# EAGLE design esp8266 rgb controller v2 (EAGLE 9.0.1)
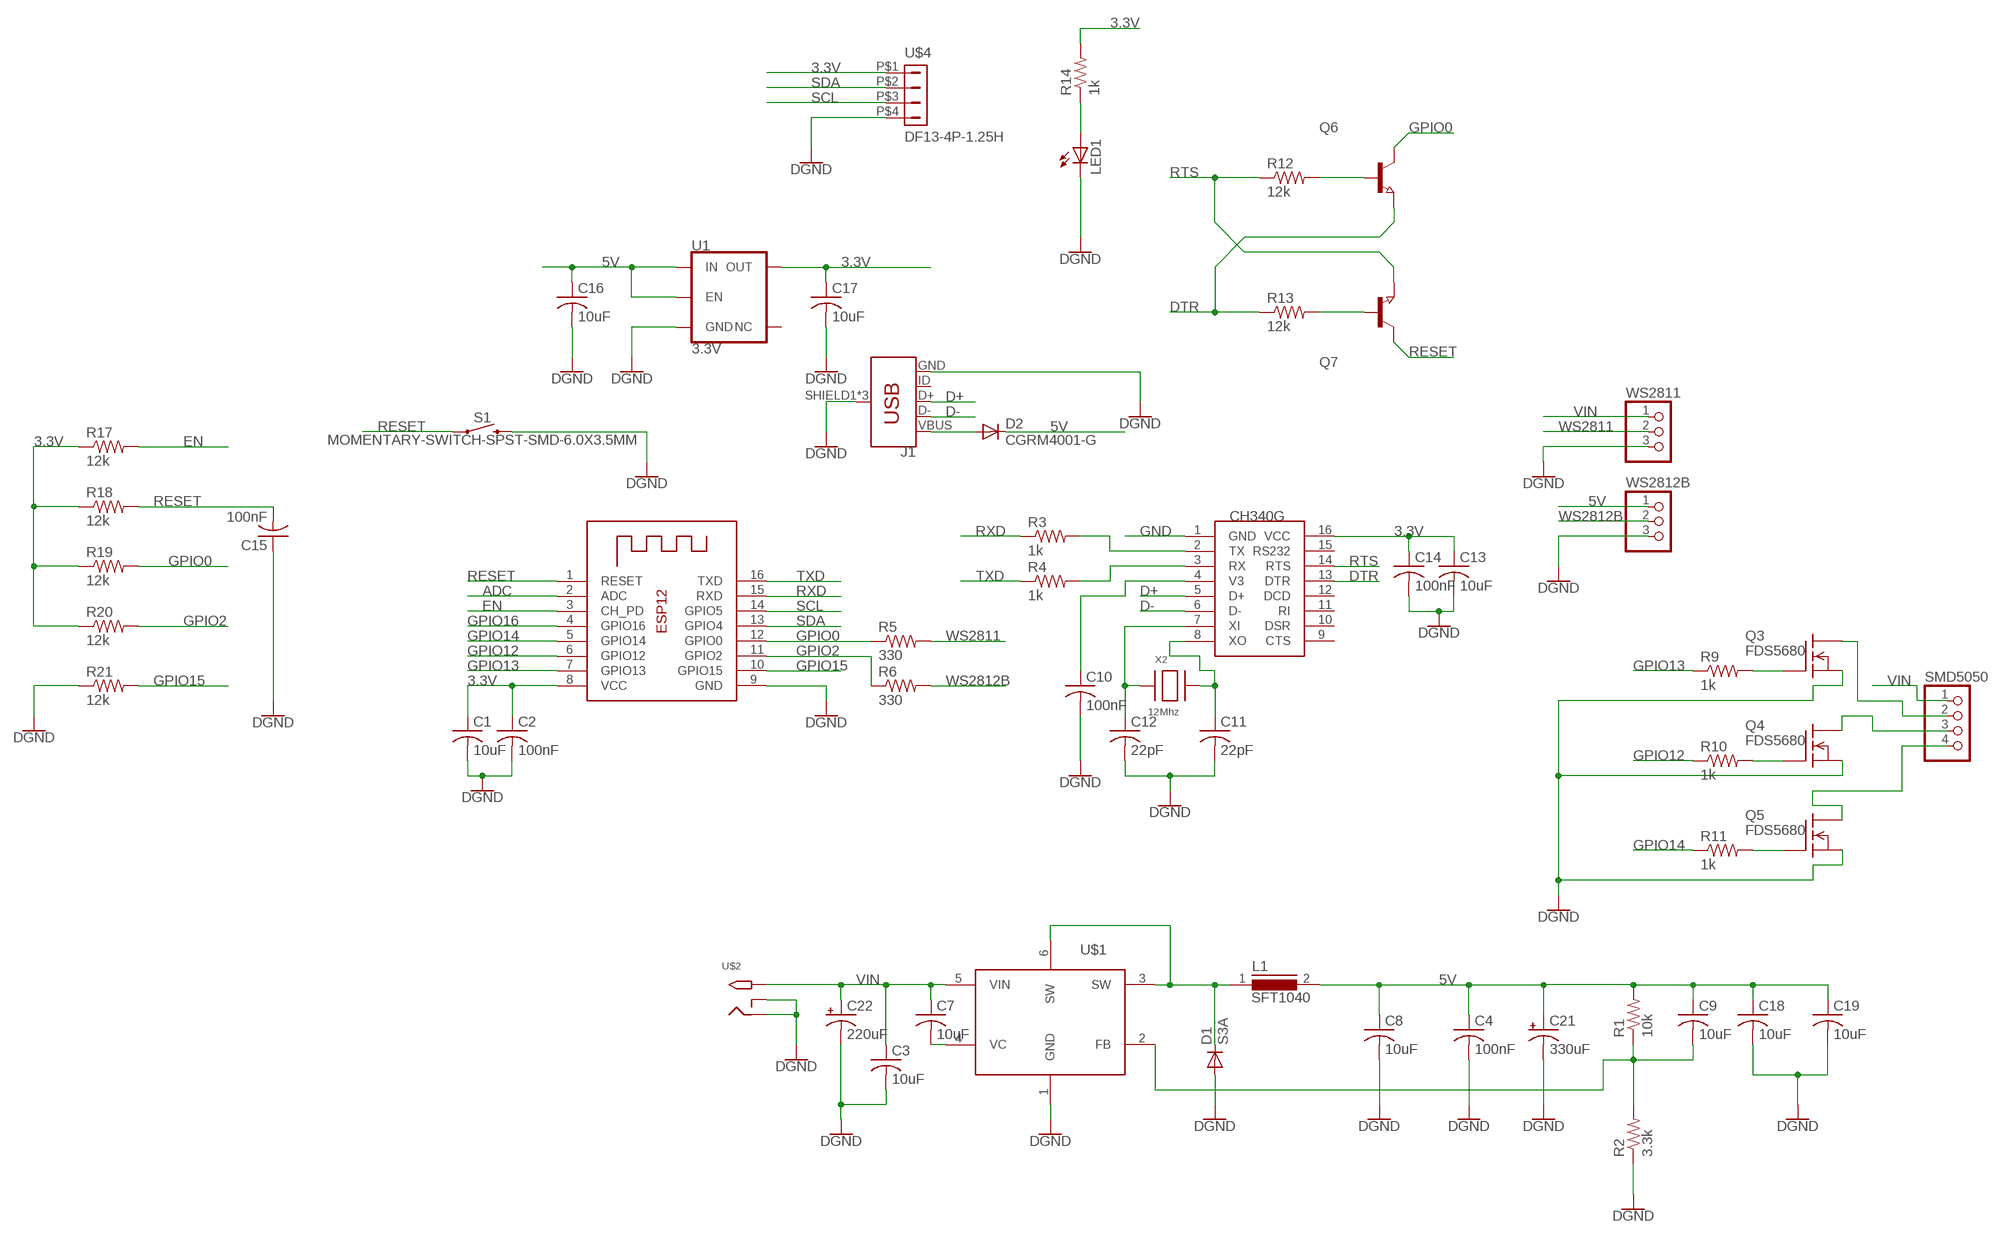
[diagram p0: schematic, sheet 1]

## Parts
C1  10uF  C-USC0805  [C0805]
C2  100nF  C-USC0805  [C0805]
C3  10uF  C-USC0805  [C0805]
C4  100nF  C-USC0805  [C0805]
C7  10uF  C-USC0805  [C0805]
C8  10uF  C-USC0805  [C0805]
C9  10uF  C-USC0805  [C0805]
C10  100nF  C-USC0805  [C0805]
C11  22pF  C-USC0805  [C0805]
C12  22pF  C-USC0805  [C0805]
C13  10uF  C-USC0805  [C0805]
C14  100nF  C-USC0805  [C0805]
C15  100nF  C-USC0805  [C0805]
C16  10uF  C-USC1210  [C1210]
C17  10uF  C-USC0805  [C0805]
C18  10uF  C-USC0805  [C0805]
C19  10uF  C-USC0805  [C0805]
C21  330uF  CPOL-US153CLV-0810  [153CLV-0810]
C22  220uF  CPOL-US153CLV-0810  [153CLV-0810]
D1  S3A  [DO214AB]
D2  CGRM4001-G  [SOD-123_MINI-SMA]
J1  USB_MICRO-BREDUCED_PASTE  [USB-B-MICRO-SMD_RED_PASTE]
L1  SFT1040  [SFT1040]
LED1  LEDCHIP-LED0603  [CHIP-LED0603]
Q3  FDS5680  [SO-8]
Q4  FDS5680  [SO-8]
Q5  FDS5680  [SO-8]
Q6  NPN-TRANSISTOR_SOT23  [SOT23]
Q7  NPN-TRANSISTOR_SOT23  [SOT23]
R1  10k  R-US_R0805  [R0805]
R2  3.3k  R-US_R0805  [R0805]
R3  1k  R-US_R0805  [R0805]
R4  1k  R-US_R0805  [R0805]
R5  330  R-US_R0805  [R0805]
R6  330  R-US_R0805  [R0805]
R9  1k  R-US_R0805  [R0805]
R10  1k  R-US_R0805  [R0805]
R11  1k  R-US_R0805  [R0805]
R12  12k  R-US_R0805  [R0805]
R13  12k  R-US_R0805  [R0805]
R14  1k  R-US_R0805  [R0805]
R17  12k  R-US_R0805  [R0805]
R18  12k  R-US_R0805  [R0805]
R19  12k  R-US_R0805  [R0805]
R20  12k  R-US_R0805  [R0805]
R21  12k  R-US_R0805  [R0805]
S1  MOMENTARY-SWITCH-SPST-SMD-6.0X3.5MM  [TACTILE_SWITCH_SMD_6.0X3.5MM]
SMD5050  PINHD-1X4  [1X04]
U1  3.3V  V_REG_AP2112K-3.3V  [SOT23-5]
U$1  XL4015  [TO263-5]
U$2  2.1MMJACKTHM  [PJ-102A]
U$3  CH340G  [SOIC16]
U$4  DF13-4P-1.25H  [DF13A-4P-1.25H]
WS2811  PINHD-1X3  [1X03]
WS2812B  PINHD-1X3  [1X03]
X1  ESP-12F  [ESP-12]
X2  12Mhz  XTALNX5032  [NX5032]

## Nets
3.3V: C1.1 C2.1 C13.1 C14.1 C17.1 R14.2 R17.1 R18.1 R19.1 R20.1 U1.5(OUT) U$3.16(VCC) U$4.P$1 X1.8(VCC)
5V: C4.1 C8.1 C9.1 C16.1 C18.1 C19.1 C21.+ D2.C L1.2 R1.2 U1.1(IN) U1.3(EN) WS2812B.1
ADC: X1.2(ADC)
D+: J1.D+ U$3.5(D+)
D-: J1.D- U$3.6(D-)
DTR: Q6.2(E) R13.1 U$3.13(DTR)
EN: R17.2 X1.3(CH_PD)
GND: C1.2 C2.2 C3.2 C4.2 C8.2 C10.2 C11.2 C12.2 C13.2 C14.2 C15.1 C16.2 C17.2 C18.2 C19.2 C21.- C22.- D1.A J1.GND J1.SHIELD1(SHIELD) J1.SHIELD2(SHIELD) J1.SHIELD3(SHIELD) LED1.C Q3.1(S) Q3.2(S) Q3.3(S) Q4.1(S) Q4.2(S) Q4.3(S) Q5.1(S) Q5.2(S) Q5.3(S) R2.1 R21.1 S1.2 U1.2(GND) U$1.1(GND) U$2.RING U$2.RING_SW U$3.1(GND) U$4.P$4 WS2811.3 WS2812B.3 X1.9(GND) ; supply symbol labelled DGND
GPIO0: Q6.3(C) R5.1 R19.2 X1.12(GPIO0)
GPIO2: R6.1 R20.2 X1.11(GPIO2)
GPIO12: R10.1 X1.6(GPIO12)
GPIO13: R9.1 X1.7(GPIO13)
GPIO14: R11.1 X1.5(GPIO14)
GPIO15: R21.2 X1.10(GPIO15)
GPIO16: X1.4(GPIO16)
N$1: Q3.5(D) Q3.6(D) Q3.7(D) Q3.8(D) SMD5050.2
N$2: D1.C L1.1 U$1.3(SW) U$1.6(SW)
N$3: Q4.5(D) Q4.6(D) Q4.7(D) Q4.8(D) SMD5050.3
N$4: D2.A J1.VBUS
N$5: R3.2 U$3.2(TX)
N$6: R4.2 U$3.3(RX)
N$7: C10.1 U$3.4(V3)
N$8: Q5.5(D) Q5.6(D) Q5.7(D) Q5.8(D) SMD5050.4
N$9: Q6.1(B) R12.2
N$10: C12.1 U$3.7(XI) X2.P$1
N$11: C11.1 U$3.8(XO) X2.P$2
N$12: Q5.4(G) R11.2
N$14: Q7.1(B) R13.2
N$15: C7.2 U$1.4(VC)
N$16: Q4.4(G) R10.2
N$17: Q3.4(G) R9.2
N$18: LED1.A R14.1
N$19: C9.2 R1.1 R2.2 U$1.2(FB)
RESET: C15.2 Q7.3(C) R18.2 S1.1 X1.1(RESET)
RTS: Q7.2(E) R12.1 U$3.14(RTS)
RXD: R3.1 X1.15(RXD)
SCL: U$4.P$3 X1.14(GPIO5)
SDA: U$4.P$2 X1.13(GPIO4)
TXD: R4.1 X1.16(TXD)
VIN: C3.1 C7.1 C22.+ SMD5050.1 U$1.5(VIN) U$2.TIP WS2811.1
WS2811: R5.2 WS2811.2
WS2812B: R6.2 WS2812B.2
Unconnected: J1.ID U1.4(NC) U$3.9(CTS) U$3.10(DSR) U$3.11(RI) U$3.12(DCD) U$3.15(RS232)

## Library data of the parts
C1-C4 C7-C19 = rcl:C-US: CAPACITOR, American symbol; SPICEPREFIX: C
C21 C22 = rcl:CPOL-US: POLARIZED CAPACITOR, American symbol; SPICEPREFIX: C
D1 = s3x_10:S3*: S3A - S3N General Purpose Rectifiers Source: http://www.fairchildsemi.com/datasheets/S3/S3A.pdf; MF: Fairchild; MPN: S3A; OC_FARNELL: 1017803; OC_NEWARK: 58K2395
D2 = diode:CGRM400*-G: Molded plasitc,JEDEC SOD-123/Mini SMA Source: Comchip CGRM4001-G.pdf
J1 = SparkFun-Connectors:USB_MICRO-B: USB Type Micro-B Connector Male/female and PTH/SMT variants SparkFun Products: SparkFun microB USB Breakout <https://www.sparkfun.com/products/12035> SparkFun USB microB Plug Breakout <https://www.sparkfun.com/products/10031> SparkFun ESP8266 Thing <https://www.sparkfun.com/products/13231>; PROD_ID: CONN-11752
L1 = inductors:SFT1040: INDUCTOR; SPICEPREFIX: L
LED1 = led:LED: LED OSRAM: - CHIPLED LG R971, LG N971, LY N971, LG Q971, LY Q971, LO R971, LY R971 LH N974, LH R974 LS Q976, LO Q976, LY Q976 LO Q996 - Hyper CHIPLED LW Q18S LB Q993, LB Q99A, LB R99A - SideLED LS A670, LO A670, LY A670, LG A670, LP A670 LB A673, LV A673, LT A673, LW A673 LH A674 LY A675 LS A676, LA A676, LO A676, LY A676, LW A676 LS A679, LY A679, LG A679 - Hyper Micro SIDELED® LS Y876, LA Y876, LO Y876, LY Y876 LT Y87S - SmartLED LW L88C, LW L88S LB L89C, LB L89S, LG L890 LS L89K, LO L89K, LY L89K LS L896, LA L896, LO L896, LY L896 - TOPLED LS T670, LO T670, LY T670, LG T670, LP T670 LSG T670, LSP T670, LSY T670, LOP T670, LYG T670 LG T671, LOG T671, LSG T671 LB T673, LV T673, LT T673, LW T673 LH T674 LS T676, LA T676, LO T676, LY T676, LB T676, LH T676, LSB T676, LW T676 LB T67C, LV T67C, LT T67C, LS T67K, LO T67K, LY T67K, LW E67C LS E67B, LA E67B, LO E67B, LY E67B, LB E67C, LV E67C, LT E67C LW T67C LS T679, LY T679, LG T679 LS T770, LO T770, LY T770, LG T770, LP T770 LB T773, LV T773, LT T773, LW T773 LH T774 LS E675, LA E675, LY E675, LS T675 LS T776, LA T776, LO T776, LY T776, LB T776 LHGB T686 LT T68C, LB T68C - Hyper Mini TOPLED® LB M676 - Mini TOPLED Santana® LG M470 LS M47K, LO M47K, LY M47K Source: http://www.osram.convergy.de LUXEON: - LUMILED® LXK2-PW12-R00, LXK2-PW12-S00, LXK2-PW14-U00, LXK2-PW14-V00 LXK2-PM12-R00, LXK2-PM12-S00, LXK2-PM14-U00 LXK2-PE12-Q00, LXK2-PE12-R00, LXK2-PE12-S00, LXK2-PE14-T00, LXK2-PE14-U00 LXK2-PB12-K00, LXK2-PB12-L00, LXK2-PB12-M00, LXK2-PB14-N00, LXK2-PB14-P00, LXK2-PB14-Q00 LXK2-PR12-L00, LXK2-PR12-M00, LXK2-PR14-Q00, LXK2-PR14-R00 LXK2-PD12-Q00, LXK2-PD12-R00, LXK2-PD12-S00 LXK2-PH12-R00, LXK2-PH12-S00 LXK2-PL12-P00, LXK2-PL12-Q00, LXK2-PL12-R00 Source: www.luxeon.com KINGBRIGHT: KA-3528ASYC Source: www.kingbright.com
Q3-Q5 = transistor-fet:FDS5680: 60V N-Channel PowerTrench TM MOSFET FAIRCHILD FDS5680.pdf
Q6 Q7 = semicon-smd-ipc:NPN-TRANSISTOR_: NPN TRANSISTOR
R1-R6 R9-R14 R17-R21 = rcl:R-US_: RESISTOR, American symbol; SPICEPREFIX: R
S1 = SparkFun-Switches:MOMENTARY-SWITCH-SPST: Momentary Switch (Pushbutton) - SPST Normally-open (NO) SPST momentary switches (buttons, pushbuttons). Variants PTH-12MM - 12mm square, through-hole Momentary Pushbutton Switch - 12mm Square <https://www.sparkfun.com/products/9190> (COM-09190) PTH-6.0MM, PTH-6.0MM-KIT - 6.0mm square, through-hole Mini Pushbutton Switch <https://www.sparkfun.com/products/97> (COM-00097) KIT package intended for soldering kit's - only one side of pads' copper is exposed. PTH-RIGHT-ANGLE-KIT - Right-angle, through-hole Right Angle Tactile Button <https://www.sparkfun.com/products/10791> - Used on SparkFun BigTime Watch Kit <https://www.sparkfun.com/products/11734> SMD-12MM - 12mm square, surface-mount Tactile Button - SMD (12mm) <https://www.sparkfun.com/products/12993> (COM-12993) Used on SparkFun PicoBoard <https://www.sparkfun.com/products/11888> SMD-4.5MM - 4.5mm Square Trackball Switch Used on SparkFun Blackberry Trackballer Breakout <https://www.sparkfun.com/products/13169> SMD-4.6MMX2.8MM - 4.60mm x 2.80mm, surface mount Used on SparkFun SAMD21 Mini Breakout <https://www.sparkfun.com/products/13664> SMD-5.2MM, SMD-5.2-REDUNDANT - 5.2mm square, surface-mount Mini Pushbutton Switch - SMD <https://www.sparkfun.com/products/8720> (COM-08720) Used on Arduino Pro Mini <https://www.sparkfun.com/products/11114> REDUNDANT package connects both switch circuits together SMD-6.0X3.5MM - 6.0 x 3.5mm, surface mount Momentary Reset Switch SMD <https://www.sparkfun.com/products/8229> (COM-08229) SMD-6.2MM-TALL - 6.2mm square, surface mount Tactile Button - SMD (6mm) <https://www.sparkfun.com/products/12992> Used on SparkFun Digital Sandbox <https://www.sparkfun.com/products/12651> SMD-RIGHT-ANGLE - Right-angle, surface mount Used on SparkFun Block for Intel® Edison - Arduino <https://www.sparkfun.com/products/13036>; PROD_ID: SWCH-00815; SF_SKU: COM-08229
SMD5050 = pinhead:PINHD-1X4: PIN HEADER
U1 = SparkFun-IC-Power:V_REG_AP2112: AP2112 - 600mA CMOS LDO Regulator w/ Enable The AP2112 is CMOS process low dropout linear regulator with enable function, the regulator delivers a guaranteed 600mA (min.) continuous load current. Features Output Voltage Accuracy: ±1.5% Output Current: 600mA (Min.) Foldback Short Current Protection: 50mA Enable Function to Turn ON/OFF VOUT Low Dropout Voltage (3.3V): 250mV (Typ.) @IOUT=600mA Excellent Load Regulation: 0.2%/A (Typ.) Excellent Line Regulation: 0.02%/V (Typ.) Low Quiescent Current: 55μA (Typ.) Low Standby Current: 0.01μA (Typ.) Low Output Noise: 50μVRMS PSRR: 100Hz -65dB, 1kHz -65dB OTSD Protection Stable with 1.0μF Flexible Cap: Ceramic, Tantalum and Aluminum Electrolytic Operation Temperature Range: -40°C to 85°C ESD: MM 400V, HBM 4000V; PROD_ID: VREG-12457
U$1 = XLSemi:XL4015
U$2 = adafruit:2.1MMJACK: 2.1mm x 5.5mm THM DC jack with internal switch. Digikey part #PJ-102A, 4UCON part #05537 2.1mm x 5.5mm SMT DC jack with internal switch. Digikey part #PJ-002A-SMT, 4UCON part #03267 By microbuilder.eu & adafruit.com
U$3 = ch340g:CH340G
U$4 = con-hirose-df13:DF13-4P-1.25: DF13-4P 1.25mm Pitch Miniature Crimping Connector.
WS2811 WS2812B = pinhead:PINHD-1X3: PIN HEADER
X1 = adafruit:ESP-12F
X2 = adafruit:XTAL: Low cost SMT crystals, no capacitors included http://www.ladyada.net/library/eagle

## Board
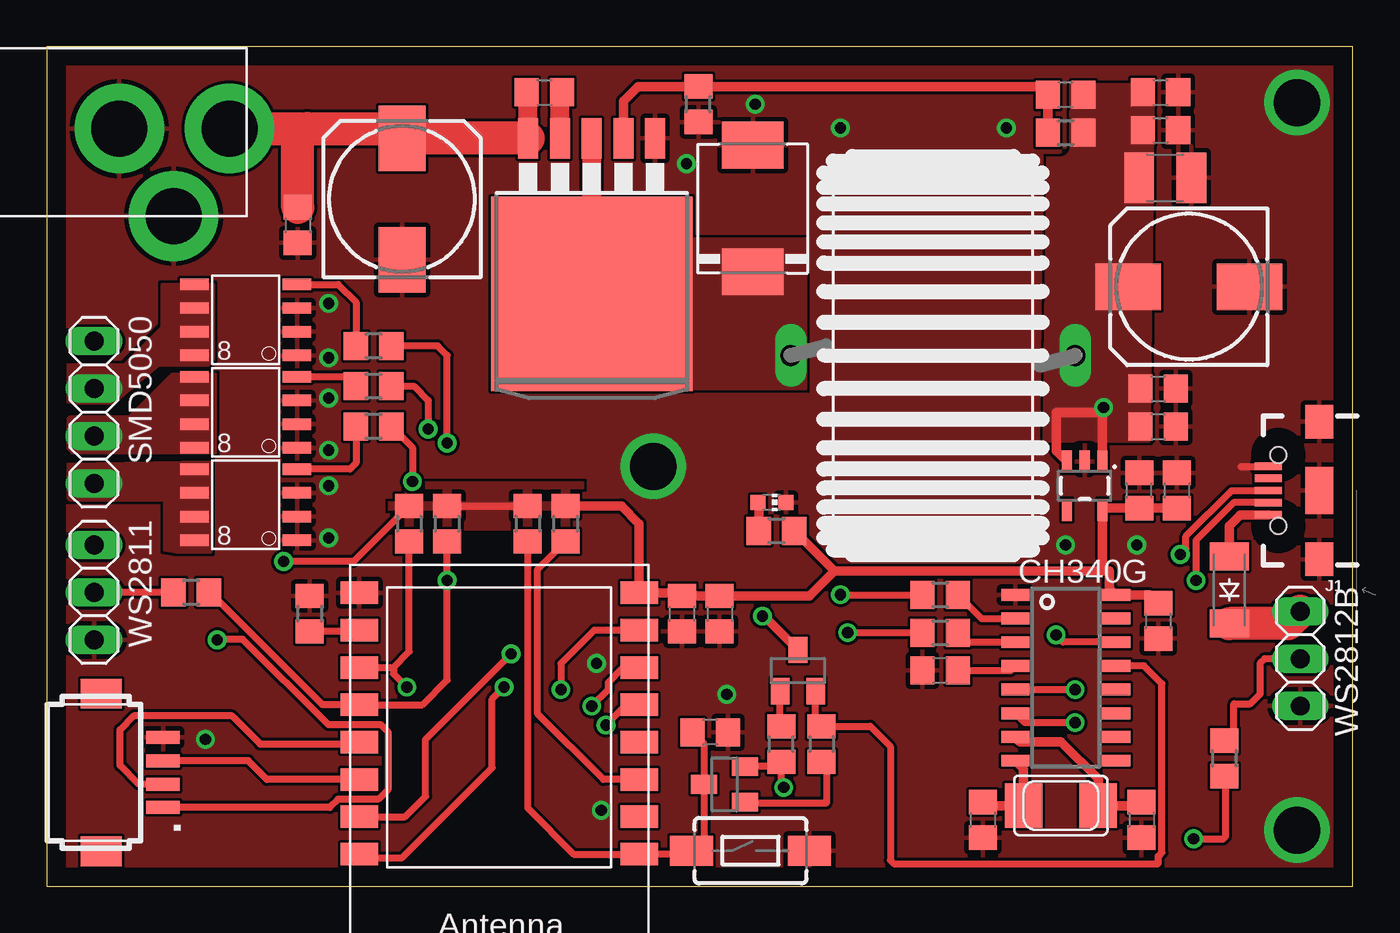
[diagram p1: board, top side]
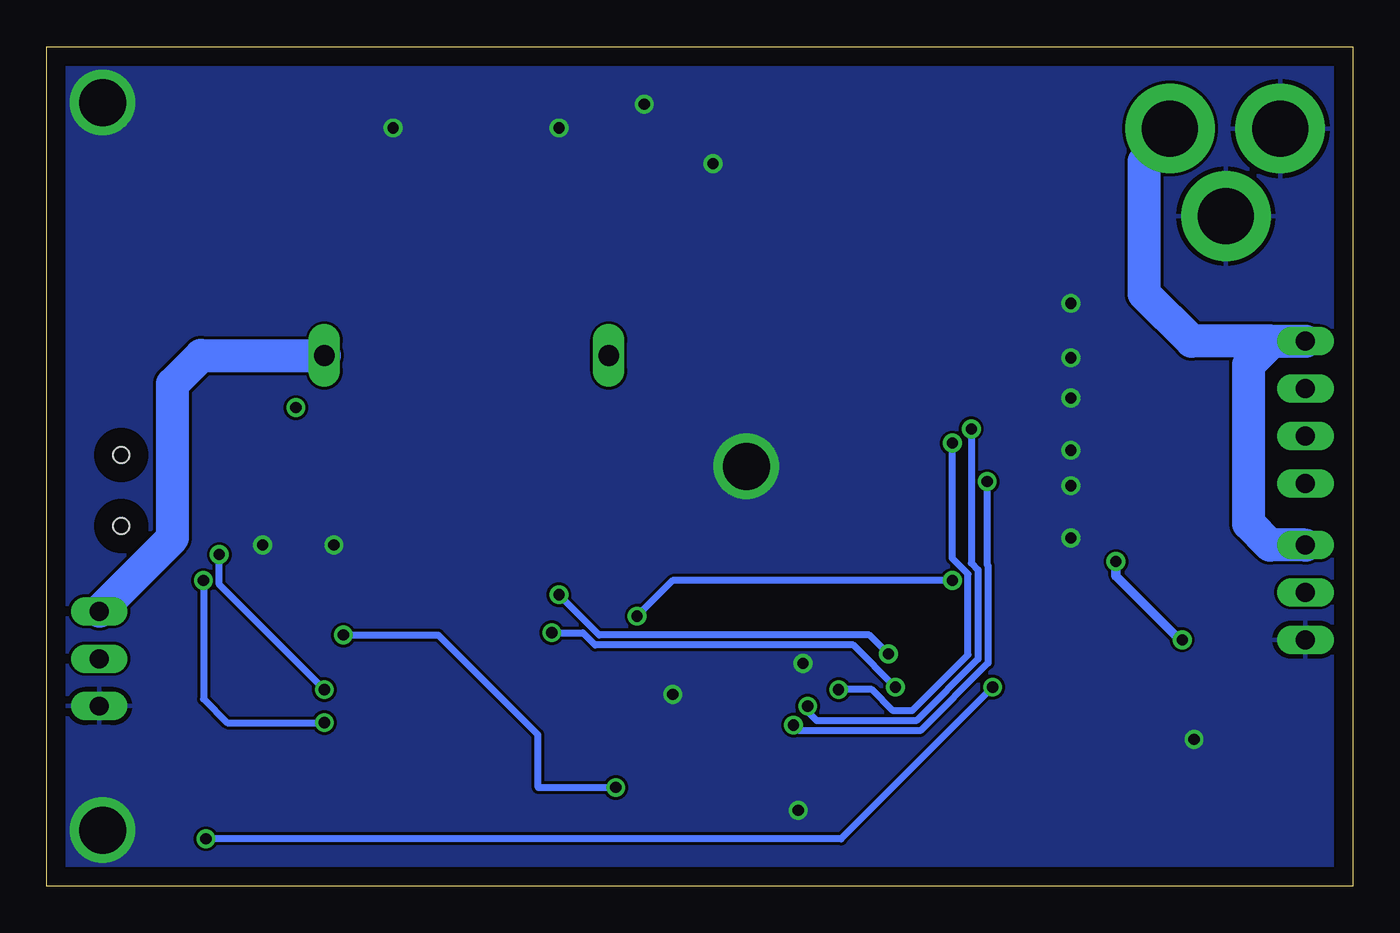
[diagram p2: board, bottom side, seen from below]

Size 70 x 45 mm. Coordinates in mm from the lower left corner, seen from the top.
Outline: 0,0 70,0 70,45 0,45 0,0
Copper layers (1*16): Top 0.035mm / dielectric 1.5mm / Bottom 0.035mm
Design rules "default": minimum track width 6mil, minimum drill 0.35mm, track to track 6mil, track to pad 6mil, pad to pad 6mil, via to via 6mil, smd to smd 6mil, copper to edge 40mil, drill to drill 6mil, minimum pad ring 10mil, minimum via ring 8mil, stop-mask expansion 4mil, vias tented up to drill 0mil, thermal gap 10mil

### Footprints (pad centres in the part's own frame; a part is rotated, then mirrored left to right if it is on the bottom)
C0805 = smd 1.3 x 1.5: 1 -0.95,0; 2 0.95,0
C1210 = smd 1.6 x 2.7: 1 -1.4,0; 2 1.4,0
153CLV-0810 = smd 3.5 x 2.5: + 3.25,0; - -3.25,0
DO214AB = smd 2.5 x 3.3: A 3.4,0; C -3.4,0
SOD-123_MINI-SMA = smd 1.5 x 2.1: A 1.8,0; C -1.8,0
USB-B-MICRO-SMD_RED_PASTE = smd 1.45 x 0.4: D+ 2.725,0; D- 2.725,0.65; GND 2.725,-1.3; ID 2.725,-0.65; VBUS 2.725,1.3 | smd 1.5 x 1.8: SHIELD1 0,3.685; SHIELD2 0,-3.685 | smd 1.5 x 2.5: SHIELD3 0,0 | hole 0.85: 2.2,1.9; 2.2,-1.9
SFT1040 = drill 1.118 long: 1 -7.62,0; 2 7.62,0
CHIP-LED0603 = smd 0.8 x 0.8: A 0,-0.75; C 0,0.75
SO-8 = smd 1.524 x 0.61: 1 -2.743,1.905; 2 -2.743,0.635; 3 -2.743,-0.635; 4 -2.743,-1.905; 5 2.743,-1.905; 6 2.743,-0.635; 7 2.743,0.635; 8 2.743,1.905
SOT23 = smd 1 x 1.4: 1 -0.95,-1.1; 2 0.95,-1.1; 3 0,1.1
R0805 = smd 1.3 x 1.5: 1 -0.95,0; 2 0.95,0
TACTILE_SWITCH_SMD_6.0X3.5MM = smd 2.3 x 1.6: 1 -3.15,0; 2 3.15,0
1X04 = drill 1.016 long: 1 -3.81,0; 2 -1.27,0; 3 1.27,0; 4 3.81,0
SOT23-5 = smd 0.55 x 1.2: 1 -0.95,-1.3; 2 0,-1.3; 3 0.95,-1.3; 4 0.95,1.3; 5 -0.95,1.3
TO263-5 = smd 1.067 x 2.159: 1 -3.404,-5.791; 2 -1.702,-5.791; 3 0,-5.791; 4 1.702,-5.791; 5 3.404,-5.791 | smd 10.8 x 10.41: 6 0,2.54
PJ-102A = drill 3 pad 4.8: RING 0.1,-3.39; RING_SW -4.6,-6.29; TIP 0.1,-9.29
SOIC16 = smd 0.635 x 1.524: 1 -4.445,-2.695; 2 -3.175,-2.695; 3 -1.905,-2.695; 4 -0.635,-2.695; 5 0.635,-2.695; 6 1.905,-2.695; 7 3.175,-2.695; 8 4.445,-2.695; 9 4.445,2.695; 10 3.175,2.695; 11 1.905,2.695; 12 0.635,2.695; 13 -0.635,2.695; 14 -1.905,2.695; 15 -3.175,2.695; 16 -4.445,2.695
DF13A-4P-1.25H = smd 1.6 x 2.2: M$0 -4.225,2.4; M$1 4.225,2.4 | smd 0.7 x 1.8: P$1 -1.875,-0.9; P$2 -0.625,-0.9; P$3 0.625,-0.9; P$4 1.875,-0.9
1X03 = drill 1.016 long: 1 -2.54,0; 2 0,0; 3 2.54,0
ESP-12 = smd 2 x 1.2: 1 -7.5,4.5; 2 -7.5,2.5; 3 -7.5,0.5; 4 -7.5,-1.5; 5 -7.5,-3.5; 6 -7.5,-5.5; 7 -7.5,-7.5; 8 -7.5,-9.5; 9 7.5,-9.5; 10 7.5,-7.5; 11 7.5,-5.5; 12 7.5,-3.5; 13 7.5,-1.5; 14 7.5,0.5; 15 7.5,2.5; 16 7.5,4.5
NX5032 = smd 2 x 2.4: P$1 2,0; P$2 -2,0

### Placement (x,y rotation side)
C1  36.07,14.61 270 top
C2  34.04,14.61 270 top
C3  13.46,35.43 270 top
C4  59.56,24.64 0 top
C7  26.67,42.55 0 top
C8  59.56,26.67 0 top
C9  54.61,42.42 180 top
C10  47.88,11.56 180 top
C11  50.16,3.56 270 top
C12  58.67,3.56 270 top
C13  59.56,14.22 270 top
C14  60.58,21.21 90 top
C15  35.56,8.26 180 top
C16  59.94,37.97 0 top
C17  58.55,21.21 90 top
C18  59.69,42.55 0 top
C19  59.69,40.51 0 top
C21  61.21,32.13 180 top
C22  19.05,36.83 90 top
D1  37.85,36.32 90 top
D2  63.37,15.88 90 top
J1  68.2,21.21 180 top
L1  47.5,28.45 0 top
LED1  38.86,20.57 270 top
Q3  10.67,30.35 180 top
Q4  10.67,25.4 180 top
Q5  10.67,20.45 180 top
Q6  40.26,11.56 0 top
Q7  36.32,5.46 90 top
R1  54.61,40.39 0 top
R2  34.92,41.91 90 top
R3  47.88,15.62 0 top
R4  47.88,13.59 0 top
R5  7.75,15.75 180 top
R6  63.12,6.86 90 top
R9  17.53,28.96 180 top
R10  17.53,26.8 180 top
R11  17.53,24.64 180 top
R12  39.37,7.62 90 top
R13  41.53,7.62 270 top
R14  39.12,19.05 0 top
R17  27.81,19.43 270 top
R18  25.78,19.43 270 top
R19  21.46,19.43 270 top
R20  19.43,19.43 270 top
R21  14.1,14.61 270 top
S1  37.72,1.91 0 top
SMD5050  2.54,25.4 270 top
U1  55.63,21.46 180 top
U$1  29.21,34.29 180 top
U$2  0.51,40.51 90 top
U$3  54.61,11.18 270 top
U$4  5.33,6.1 90 top
WS2811  2.54,15.75 270 top
WS2812B  67.18,12.19 270 top
X1  24.26,6.22 180 top
X2  54.36,4.32 0 top

### Tracks (layer width: path | path; a pad name or v marks a point on that pad's centre or on a via)
3.3V  (via drill 0.6)
  Top 0.381: R20.1 16.45,17.4 v12.7,17.4 | U$4.P$1 15.17,4.22 15.62,4.67 17.79,4.67 18.29,5.17 18.29,8.28 17.9,8.67 15.09,8.67 10.52,13.24 9.18,13.24 v9.14,13.21 | R19.1 R18.1
  Top 0.508: R14.2 42.23,16.89 | 42.23,16.89 56.39,16.89 | 56.39,16.89 56.96,16.89 56.96,15.97 U$3.16 59.12,15.62 C13.1 59.75,14.99 | C2.1 34.16,15.55 | 34.16,15.55 C1.1 40.89,15.55 42.23,16.89 | 34.16,15.55 33.99,15.72 X1.8 31.76,19.42 30.8,20.38 R17.1 | 56.39,16.89 56.58,17.08 U1.5 56.67,20.26 C17.1 C14.1
  Bottom 0.508: v9.14,13.21 9.27,13.21 12.7,16.64 v12.7,17.4
  pour Top: 18.54,19.3 28.7,19.3 28.7,21.46 18.54,21.46
5V  (via drill 0.6)
  Top 0.508: 58.77,26.67 C8.1 | 63.63,13.82 D2.C 64.03,14.73 | U1.3 54.1,23.34 54.1,25.4 56.39,25.4 v56.64,25.65 56.58,25.59 U1.1
  Top 1.778: WS2812B.1 66.53,14.07 D2.C
  Bottom 1.778: WS2812B.1 63.25,18.67 63.25,26.92 61.72,28.45 L1.2
  pour Top (isolate 0.508, no thermals): 53.72,42.93 53.47,23.88 59.05,23.88 59.31,42.93
D+  (via drill 0.6)
  Top 0.381: U$3.5 v55.12,10.54 | v60.75,17.78 61.06,18.09 61.06,18.76 63.51,21.21 J1.D+
  Bottom 0.381: v55.12,10.54 57.47,12.89 60.75,16.17 v60.75,17.78
D-  (via drill 0.6)
  Top 0.381: J1.D- 63.61,20.56 61.59,18.54 v61.59,16.38 | v55.12,8.76 52.42,8.76 U$3.6
  Bottom 0.381: v61.59,16.38 61.59,10.03 60.33,8.76 v55.12,8.76
DTR
  Top 0.381: Q6.2 41.21,8.89 R13.1 44.13,8.57 45.21,7.49 45.21,1.4 45.4,1.21 59.56,1.21 59.56,1.61 59.77,1.81 59.77,10.85 58.8,11.81 U$3.13
EN
  Top 0.381: X1.3 29.84,5.72 26.31,9.25 26.31,16.98 R17.2
GND  (via drill 0.6, 2.5)
  Top 0.381: J1.GND 65.44,22.48 64.01,22.48
  other vias: 29.46,11.94 36.45,10.29 29.72,4.06 67,3 67,42 54.61,18.29 58.42,18.29 37.97,41.91 34.29,38.73 32.5,22.5 8.51,7.87 15.11,18.67 15.11,21.46 15.11,23.37 15.11,26.16 15.11,28.32 15.11,31.24 42.55,40.64 51.44,40.64
  pour Top (isolate 0.127, rank 6): -1.27,45.09 -0.89,-0.64 70.36,-0.76 69.98,44.7
  pour Bottom (isolate 0.127): -0.13,45.09 -0.25,0.13 70.1,0 70.36,44.96
GPIO0  (via drill 0.6)
  Top 0.381: 16.64,9.72 X1.12 20.14,9.72 21.46,11.05 v21.46,16.38 R19.2 | 16.64,9.72 14.79,9.72 8.76,15.75 R5.1 | 16.71,9.65 16.64,9.72
  Top 0.508: Q6.3 38.44,14.48 v38.35,14.48
  Bottom 0.381: v21.46,16.38 36.45,16.38 v38.35,14.48
GPIO2  (via drill 0.6)
  Top 0.381: v61.47,2.54 63.05,2.54 63.18,2.67 63.18,5.85 R6.1 | X1.11 18.58,11.72 | 18.58,11.72 19.43,12.57 R20.2 | 18.58,11.72 18.58,11.39 v19.3,10.67
  Bottom 0.381: v19.3,10.67 27.43,2.54 v61.47,2.54
GPIO12  (via drill 0.6)
  Top 0.381: R10.1 19.68,26.8 20.45,26.04 v20.45,24.51 | 30.87,11.72 30.9,11.72 | X1.6 30.9,11.72 | v29.21,9.65 30.1,10.54 30.1,10.92 30.9,11.72
  Bottom 0.381: v20.45,24.51 20.45,17.32 20.08,16.95 20.08,12.18 23.4,8.87 28.73,8.87 29.21,9.34 v29.21,9.65
GPIO13  (via drill 0.6)
  Top 0.381: X1.7 29.34,13.72 27.56,11.94 v27.56,10.54 | R9.1 20.95,28.96 21.46,28.45 v21.46,23.75
  Bottom 0.381: v27.56,10.54 25.78,10.54 24.64,9.4 23.62,9.4 20.62,12.4 20.62,16.73 21.46,17.58 v21.46,23.75
GPIO14  (via drill 0.6)
  Top 0.381: R11.1 19.6,23.51 v19.6,21.69 | v29.97,8.64 31.06,9.72 X1.5
  Bottom 0.381: v19.6,21.69 19.6,17.23 19.55,17.18 19.55,11.96 23.18,8.33 29.67,8.33 v29.97,8.64
GPIO15
  Top 0.381: X1.10 16.69,13.65 R21.2
N$1
  pour Top (no thermals): 8.89,32.26 8.89,28.19 8.64,27.94 5.97,27.94 3.56,25.91 1.52,25.91 0.76,26.04 0.64,26.16 0.64,27.43 1.14,27.94 4.19,27.94 6.22,29.97 6.22,32.26
N$2
  Top 1.016: U$1.3 U$1.6
  pour Top (rank 5, no thermals): 26.8,34.67 40.64,34.67 40.64,26.67 26.8,26.67
N$3
  pour Top (no thermals): 1.27,25.15 4.45,25.15 6.73,27.43 9.02,27.43 9.02,23.24 1.4,23.24 1.02,23.62 1.02,24.89
N$4
  Top 0.508: J1.VBUS 63.98,19.91 63.37,19.3 D2.A
N$5
  Top 0.381: R3.2 50.1,14.35 U$3.2
N$6
  Top 0.381: R4.2 49.34,13.08 U$3.3
N$7
  Top 0.381: C10.1 51.66,11.56 U$3.4
N$8
  pour Top (no thermals): 1.14,22.61 8.76,22.73 8.76,17.91 6.99,17.91 6.35,18.03 6.35,20.7 1.27,20.7 1.14,20.83
N$9
  Top 0.381: R12.2 39.31,8.63 Q6.1
N$10
  Top 0.508: U$3.7 52.17,7.75 54.36,7.75 56.36,5.75 X2.P$1 58.49,4.32 C12.1
N$11
  Top 0.508: C11.1 50.35,4.32 X2.P$2 52.36,6.29 U$3.8
N$12
  Top 0.381: R11.2 16.58,22.67 16.26,22.35 Q5.4
N$14
  Top 0.381: R13.2 41.78,6.42 41.78,4.45 37.49,4.45 Q7.1
N$15
  Top 1.016: U$1.4 27.51,42.55 C7.2
N$16
  Top 0.254: 15.94,27.3 16.07,27.2 R10.2
  Top 0.381: Q4.4 15.97,27.3 16.07,27.2
N$17
  Top 0.381: Q3.4 15.62,32.26 16.58,31.3 R9.2
N$18
  Top 0.508: R14.1 38.17,20.52 LED1.A
N$19
  Top 0.508: R1.1 C9.2 53.66,42.86 R2.2 31.68,42.86 30.91,42.09 U$1.2
RESET
  Top 0.381: C15.2 35.22,7.64 Q7.3 35.22,2.56 S1.1 34.39,1.72 X1.1 28.25,1.72 25.78,4.19 R18.2
RTS  (via drill 0.6)
  Top 0.381: Q7.2 39.11,6.41 R12.1 39.37,5.42 v39.5,5.29 | U$3.14 54.48,13.08 v54.1,13.46
  Bottom 0.381: v54.1,13.46 49.02,13.46 43.69,8.13 43.69,5.33 43.65,5.29 v39.5,5.29
RXD  (via drill 0.6)
  Top 0.381: X1.15 19.22,3.72 20.32,4.83 20.32,7.87 v24.89,12.45 | v42.55,15.62 R3.1
  Bottom 0.381: v42.55,15.62 40.39,13.46 25.91,13.46 v24.89,12.45
SCL
  Top 0.381: X1.14 11.8,5.72 10.8,6.72 U$4.P$3
SDA
  Top 0.381: U$4.P$2 4.94,5.47 3.94,6.48 3.94,8.38 4.7,9.14 9.91,9.14 11.43,7.62 16.65,7.62 X1.13
TXD  (via drill 0.6)
  Top 0.381: R4.1 v42.93,13.59 | X1.16 16.96,1.52 19.05,1.52 23.88,6.35 23.88,10.03 v24.51,10.67
  Bottom 0.381: v42.93,13.59 41.27,13.59 40.61,12.93 26.77,12.93 v24.51,10.67
VIN
  Top 0.381: C22.+
  Top 1.016: U$1.5 25.81,42.55 C7.1 | 9.27,40.97 19.07,40.97
  Top 1.778: U$1.5 C22.+ 18.52,40.61 13.97,40.61 | 13.97,40.61 U$2.TIP 9.63,40.61 9.27,40.97 | C3.1 13.46,40.1 13.97,40.61
  Bottom 1.778: U$2.TIP 11.18,38.85 11.18,31.75 8.64,29.21 4.33,29.21 | 4.33,29.21 SMD5050.1 | WS2811.1 4.45,18.29 5.59,19.43 5.59,27.95 4.33,29.21
WS2811
  Top 0.381: R5.2 WS2811.2
WS2812B
  Top 0.381: WS2812B.2 65.28,12.19 65.02,11.94 65.02,10.29 64.52,9.78 63.63,9.78 63.63,8.32 R6.2